# Altium project FlyconforDSP.PrjPcb
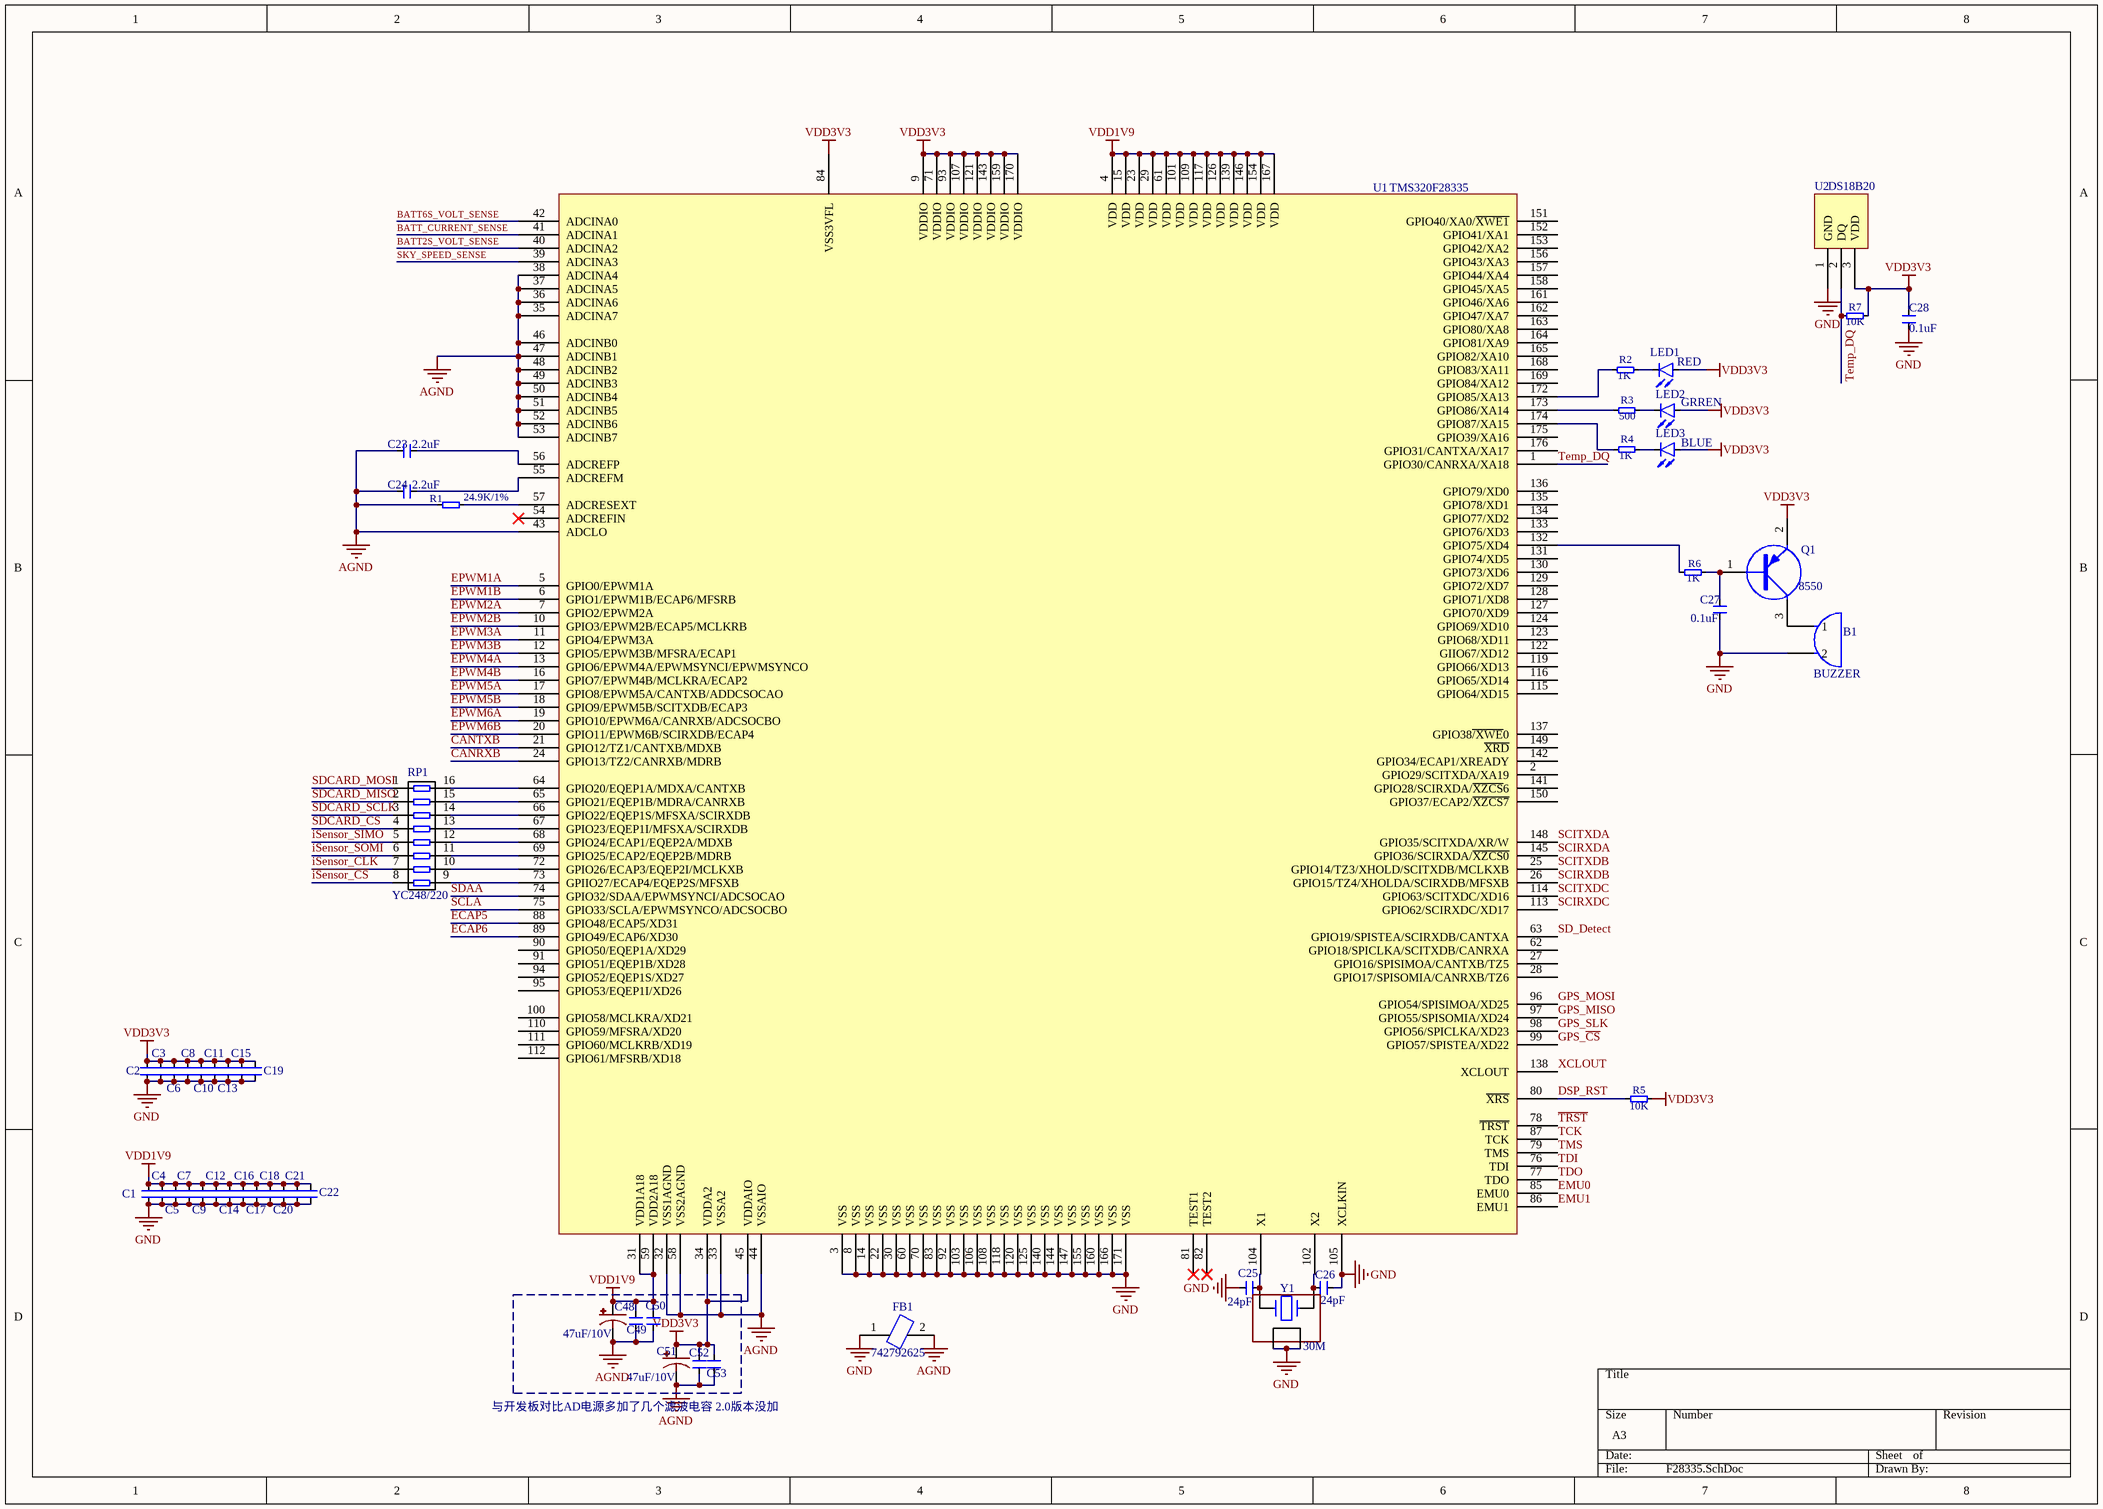
[diagram p0: F28335.SchDoc]
7 sheets, 122 parts. Net scope: global (net labels, ports and power ports of the same name join across sheets).
Board files: PCB.PcbDoc, PCB2.0.PcbDoc
Sheets:
  F28335.SchDoc
  POWER.SchDoc
  IO.SchDoc
  PWM&CAN&SD.SchDoc
  AD.SchDoc
  SBUS.SchDoc
  GPS.SchDoc

## Sheet F28335.SchDoc
size A3

### Parts
B1  BUZZER  [SMD-Beep(9.6*9.6)]
C1  0.1uF  [0603C]  (value not drawn)
C2  0.1uF  [0603C]  (value not drawn)
C3  0.1uF  [0603C]  (value not drawn)
C4  0.1uF  [0603C]  (value not drawn)
C5  0.1uF  [0603C]  (value not drawn)
C6  0.1uF  [0603C]  (value not drawn)
C7  0.1uF  [0603C]  (value not drawn)
C8  0.1uF  [0603C]  (value not drawn)
C9  0.1uF  [0603C]  (value not drawn)
C10  0.1uF  [0603C]  (value not drawn)
C11  0.1uF  [0603C]  (value not drawn)
C12  0.1uF  [0603C]  (value not drawn)
C13  0.1uF  [0603C]  (value not drawn)
C14  0.1uF  [0603C]  (value not drawn)
C15  0.1uF  [0603C]  (value not drawn)
C16  0.1uF  [0603C]  (value not drawn)
C17  0.1uF  [0603C]  (value not drawn)
C18  0.1uF  [0603C]  (value not drawn)
C19  0.1uF  [0603C]  (value not drawn)
C20  0.1uF  [0603C]  (value not drawn)
C21  0.1uF  [0603C]  (value not drawn)
C22  0.1uF  [0603C]  (value not drawn)
C23  2.2uF  [0603C]
C24  2.2uF  [0603C]
C25  24pF  [0603C]
C26  24pF  [0603C]
C27  0.1uF  [0603C]
C28  0.1uF  [0603C]
C48  47uF/10V  [3216/A]
C49  0.1uF  [0603C]  (value not drawn)
C50  0.1uF  [0603C]  (value not drawn)
C51  47uF/10V  [3216/A]
C52  0.1uF  [0603C]  (value not drawn)
C53  0.1uF  [0603C]  (value not drawn)
FB1  742792625  [0603-FB]
LED1  RED  [0603D]
LED2  GRREN  [0603D]
LED3  BLUE  [0603D]
Q1  8550  [SOT23-PNP]
R1  24.9K/1%  [0603R]
R2  1K  [0603R]
R3  500  [0603R]
R4  1K  [0603R]
R5  10K  [0603R]
R6  1K  [0603R]
R7  10K  [0603R]
RP1  YC248/220  [YC248(0603x8)]
U1  TMS320F28335  [LQFP-176]
U2  DS18B20  [TO-92]
Y1  30M  [5032Y]

### Nets
AGND: C23.2 C24.2 C48.2 C49.2 C50.2 C51.2 C52.2 C53.2 FB1.2 R1.1 U1.32(VSS1AGND) U1.33(VSSA2) U1.35(ADCINA7) U1.36(ADCINA6) U1.37(ADCINA5) U1.38(ADCINA4) U1.43(ADCLO) U1.44(VSSAIO) U1.46(ADCINB0) U1.47(ADCINB1) U1.48(ADCINB2) U1.49(ADCINB3) U1.50(ADCINB4) U1.51(ADCINB5) U1.52(ADCINB6) U1.53(ADCINB7) U1.58(VSS2AGND)
GND: B1.2 C1.2 C2.2 C3.2 C4.2 C5.2 C6.2 C7.2 C8.2 C9.2 C10.2 C11.2 C12.2 C13.2 C14.2 C15.2 C16.2 C17.2 C18.2 C19.2 C20.2 C21.2 C22.2 C25.2 C26.1 C27.1 C28.1 FB1.1 U1.3(VSS) U1.8(VSS) U1.14(VSS) U1.22(VSS) U1.30(VSS) U1.60(VSS) U1.70(VSS) U1.83(VSS) U1.92(VSS) U1.103(VSS) U1.105(XCLKIN) U1.106(VSS) U1.108(VSS) U1.118(VSS) U1.120(VSS) U1.125(VSS) U1.140(VSS) U1.144(VSS) U1.147(VSS) U1.155(VSS) U1.160(VSS) U1.166(VSS) U1.171(VSS) U2.1(GND) Y1.2 Y1.4
VDD1V9: C1.1 C4.1 C5.1 C7.1 C9.1 C12.1 C14.1 C16.1 C17.1 C18.1 C20.1 C21.1 C22.1 C48.1 C49.1 C50.1 U1.4(VDD) U1.15(VDD) U1.23(VDD) U1.29(VDD) U1.31(VDD1A18) U1.59(VDD2A18) U1.61(VDD) U1.101(VDD) U1.109(VDD) U1.117(VDD) U1.126(VDD) U1.139(VDD) U1.146(VDD) U1.154(VDD) U1.167(VDD)
VDD3V3: C2.1 C3.1 C6.1 C8.1 C10.1 C11.1 C13.1 C15.1 C19.1 C28.2 C51.1 C52.1 C53.1 LED1.1 LED2.1 LED3.1 Q1.2(E) R5.2 R7.1 U1.9(VDDIO) U1.34(VDDA2) U1.45(VDDAIO) U1.71(VDDIO) U1.84(VSS3VFL) U1.93(VDDIO) U1.107(VDDIO) U1.121(VDDIO) U1.143(VDDIO) U1.159(VDDIO) U1.170(VDDIO) U2.3(VDD)
BATT2S_VOLT_SENSE: U1.40(ADCINA2)
BATT6S_VOLT_SENSE: U1.42(ADCINA0)
BATT_CURRENT_SENSE: U1.41(ADCINA1)
CANRXB: U1.24(GPIO13/TZ2/CANRXB/MDRB)
CANTXB: U1.21(GPIO12/TZ1/CANTXB/MDXB)
DSP_RST: R5.1 U1.80(~{XRS})
ECAP5: U1.88(GPIO48/ECAP5/XD31)
ECAP6: U1.89(GPIO49/ECAP6/XD30)
EMU0: U1.85(EMU0)
EMU1: U1.86(EMU1)
EPWM1A: U1.5(GPIO0/EPWM1A)
EPWM1B: U1.6(GPIO1/EPWM1B/ECAP6/MFSRB)
EPWM2A: U1.7(GPIO2/EPWM2A)
EPWM2B: U1.10(GPIO3/EPWM2B/ECAP5/MCLKRB)
EPWM3A: U1.11(GPIO4/EPWM3A)
EPWM3B: U1.12(GPIO5/EPWM3B/MFSRA/ECAP1)
EPWM4A: U1.13(GPIO6/EPWM4A/EPWMSYNCI/EPWMSYNCO)
EPWM4B: U1.16(GPIO7/EPWM4B/MCLKRA/ECAP2)
EPWM5A: U1.17(GPIO8/EPWM5A/CANTXB/ADDCSOCAO)
EPWM5B: U1.18(GPIO9/EPWM5B/SCITXDB/ECAP3)
EPWM6A: U1.19(GPIO10/EPWM6A/CANRXB/ADCSOCBO)
EPWM6B: U1.20(GPIO11/EPWM6B/SCIRXDB/ECAP4)
GPS_~{CS}: U1.99(GPIO57/SPISTEA/XD22)
GPS_MISO: U1.97(GPIO55/SPISOMIA/XD24)
GPS_MOSI: U1.96(GPIO54/SPISIMOA/XD25)
GPS_SLK: U1.98(GPIO56/SPICLKA/XD23)
~{iSensor_CS}: RP1.8
iSensor_CLK: RP1.7
iSensor_SIMO: RP1.5
iSensor_SOMI: RP1.6
SCIRXDA: U1.145(GPIO36/SCIRXDA/~{XZCS0})
SCIRXDB: U1.26(GPIO15/TZ4/XHOLDA/SCIRXDB/MFSXB)
SCIRXDC: U1.113(GPIO62/SCIRXDC/XD17)
SCITXDA: U1.148(GPIO35/SCITXDA/XR/W)
SCITXDB: U1.25(GPIO14/TZ3/XHOLD/SCITXDB/MCLKXB)
SCITXDC: U1.114(GPIO63/SCITXDC/XD16)
SCLA: U1.75(GPIO33/SCLA/EPWMSYNCO/ADCSOCBO)
SD_Detect: U1.63(GPIO19/SPISTEA/SCIRXDB/CANTXA)
SDAA: U1.74(GPIO32/SDAA/EPWMSYNCI/ADCSOCAO)
SDCARD_CS: RP1.4
SDCARD_MISO: RP1.2
SDCARD_MOSI: RP1.1
SDCARD_SCLK: RP1.3
SKY_SPEED_SENSE: U1.39(ADCINA3)
~{TRST}: U1.78(~{TRST})
TCK: U1.87(TCK)
TDI: U1.76(TDI)
TDO: U1.77(TDO)
Temp_DQ: R7.2 U1.1(GPIO30/CANRXA/XA18) U2.2(DQ)
TMS: U1.79(TMS)
XCLOUT: U1.138(XCLOUT)
NetB1_1: B1.1 Q1.3(C)
NetC23_1: C23.1 U1.56(ADCREFP)
NetC24_1: C24.1 U1.55(ADCREFM)
NetC25_1: C25.1 U1.104(X1) Y1.1
NetC26_2: C26.2 U1.102(X2) Y1.3
NetC27_2: C27.2 Q1.1(B) R6.2
NetLED1_2: LED1.2 R2.2
NetLED2_2: LED2.2 R3.2
NetLED3_2: LED3.2 R4.2
NetR1_2: R1.2 U1.57(ADCRESEXT)
NetR2_1: R2.1 U1.172(GPIO85/XA13)
NetR3_1: R3.1 U1.173(GPIO86/XA14)
NetR4_1: R4.1 U1.174(GPIO87/XA15)
NetR6_1: R6.1 U1.132(GPIO75/XD4)
NetRP1_9: RP1.9 U1.73(GPIIO27/ECAP4/EQEP2S/MFSXB)
NetRP1_10: RP1.10 U1.72(GPIO26/ECAP3/EQEP2I/MCLKXB)
NetRP1_11: RP1.11 U1.69(GPIO25/ECAP2/EQEP2B/MDRB)
NetRP1_12: RP1.12 U1.68(GPIO24/ECAP1/EQEP2A/MDXB)
NetRP1_13: RP1.13 U1.67(GPIO23/EQEP1I/MFSXA/SCIRXDB)
NetRP1_14: RP1.14 U1.66(GPIO22/EQEP1S/MFSXA/SCIRXDB)
NetRP1_15: RP1.15 U1.65(GPIO21/EQEP1B/MDRA/CANRXB)
NetRP1_16: RP1.16 U1.64(GPIO20/EQEP1A/MDXA/CANTXB)

Not connected (* = marked no-connect by the designer): U1 2(GPIO29/SCITXDA/XA19) 27(GPIO16/SPISIMOA/CANTXB/TZ5) 28(GPIO17/SPISOMIA/CANRXB/TZ6) 54(ADCREFIN)* 62(GPIO18/SPICLKA/SCITXDB/CANRXA) 81(TEST1)* 82(TEST2)* 90(GPIO50/EQEP1A/XD29) 91(GPIO51/EQEP1B/XD28) 94(GPIO52/EQEP1S/XD27) 95(GPIO53/EQEP1I/XD26) 100(GPIO58/MCLKRA/XD21) 110(GPIO59/MFSRA/XD20) 111(GPIO60/MCLKRB/XD19) 112(GPIO61/MFSRB/XD18) 115(GPIO64/XD15) 116(GPIO65/XD14) 119(GPIO66/XD13) 122(GIIO67/XD12) 123(GPIO68/XD11) 124(GPIO69/XD10) 127(GPIO70/XD9) 128(GPIO71/XD8) 129(GPIO72/XD7) 130(GPIO73/XD6) 131(GPIO74/XD5) 133(GPIO76/XD3) 134(GPIO77/XD2) 135(GPIO78/XD1) 136(GPIO79/XD0) 137(GPIO38~{/XWE}0) 141(GPIO28/SCIRXDA/~{XZCS}6) 142(GPIO34/ECAP1/XREADY) 149(~{XRD}) 150(GPIO37/ECAP2/~{XZCS7}) 151(GPIO40/XA0/~{XWE1}) 152(GPIO41/XA1) 153(GPIO42/XA2) 156(GPIO43/XA3) 157(GPIO44/XA4) 158(GPIO45/XA5) 161(GPIO46/XA6) 162(GPIO47/XA7) 163(GPIO80/XA8) 164(GPIO81/XA9) 165(GPIO82/XA10) 168(GPIO83/XA11) 169(GPIO84/XA12) 175(GPIO39/XA16) 176(GPIO31/CANTXA/XA17)

### Notes on the sheet
- 与开发板对比AD电源多加了几个滤波电容 2.0版本没加

### Library data of the parts
C1-C28 C49 C50 C52 C53 = C
C48 C51 = C-POLAR
FB1 = FB
LED1-LED3 = LED
Q1 = PNP: PNP Transistor
R1-R7 = R
RP1 = RP
Y1 = Crystal-4

## Sheet POWER.SchDoc
size A3
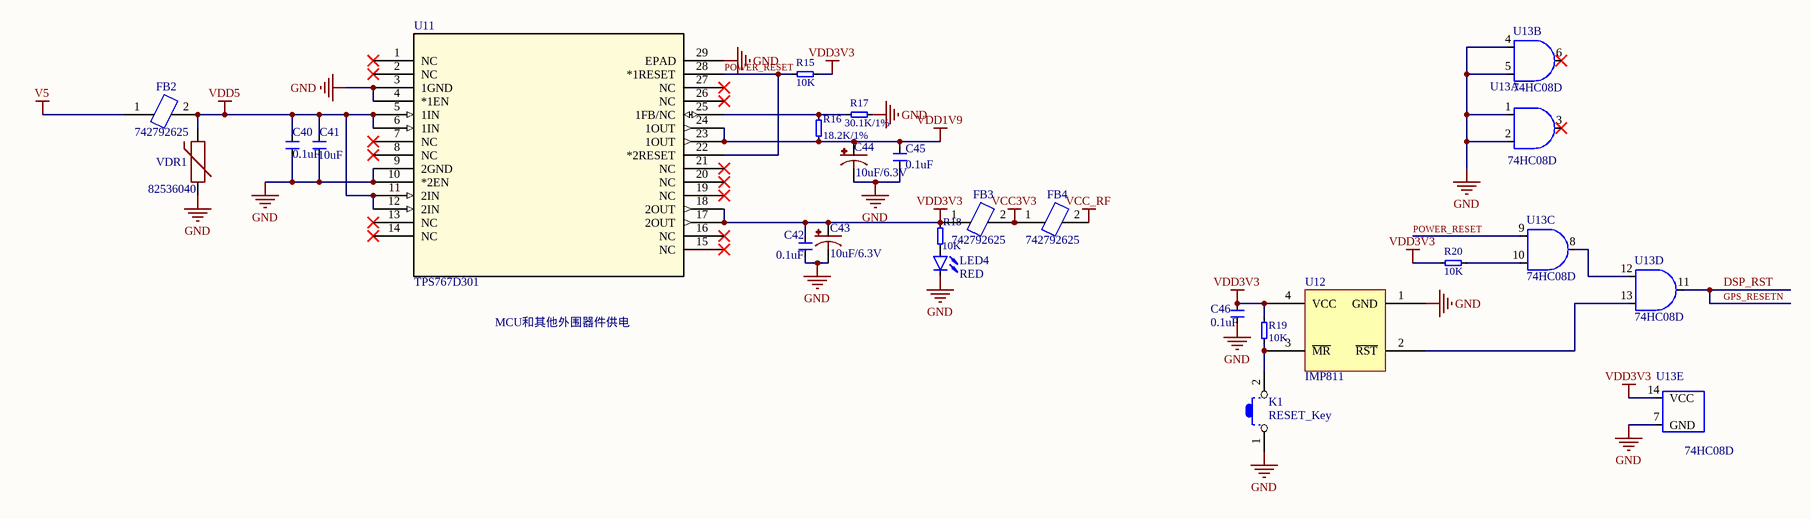
[diagram p1: POWER.SchDoc]

### Parts
C40  0.1uF  [0603C]
C41  10uF  [0603C]
C42  0.1uF  [0603C]
C43  10uF/6.3V  [3216/A]
C44  10uF/6.3V  [3216/A]
C45  0.1uF  [0603C]
C46  0.1uF  [0603C]
FB2  742792625  [0603-FB]
FB3  742792625  [0603-FB]
FB4  742792625  [0603-FB]
K1  RESET_Key  [KEY(2*4*3.5)]
LED4  RED  [0603D]
R15  10K  [0603R]
R16  18.2K/1%  [0603R]
R17  30.1K/1%  [0603R]
R18  10K  [0603R]
R19  10K  [0603R]
R20  10K  [0603R]
U11  TPS767D301  [TPS767D301]
U12  IMP811  [IMP811]
U13  74HC08D  [TSSOP14]  (parts A,B,C,D,E of 5)
VDR1  82536040  [0603R]

### Nets
GND: C40.1 C41.1 C42.1 C43.2 C44.2 C45.1 C46.1 K1.1 LED4.2 R17.1 U11.3(1GND) U11.4(*1EN) U11.9(2GND) U11.10(*2EN) U11.29(EPAD) U12.1(GND) U13.1 U13.2 U13.4 U13.5 U13.7(GND) VDR1.1
V5: FB2.1
VCC3V3: FB3.2 FB4.1
VCC_RF: FB4.2
VDD1V9: C44.1 C45.2 R16.1 U11.23(1OUT) U11.24(1OUT)
VDD3V3: C42.2 C43.1 C46.2 FB3.1 R15.2 R18.2 R19.2 R20.2 U11.17(2OUT) U11.18(2OUT) U12.4(VCC) U13.14(VCC)
VDD5: C40.2 C41.2 FB2.2 U11.5(1IN) U11.6(1IN) U11.11(2IN) U11.12(2IN) VDR1.2
DSP_RST: U13.11  [also labelled GPS_RESETN]
POWER_RESET: R15.1 U11.22(*2RESET) U11.28(*1RESET) U13.9
NetK1_2: K1.2 R19.1 U12.3(~{MR})
NetLED4_1: LED4.1 R18.1
NetR16_2: R16.2 R17.2 U11.25(1FB/NC)
NetR20_1: R20.1 U13.10
NetU12_2: U12.2(~{RST}) U13.13
NetU13_8: U13.8 U13.12

Not connected (* = marked no-connect by the designer): U11 1(NC)* 2(NC)* 7(NC)* 8(NC)* 13(NC)* 14(NC)* 15(NC)* 16(NC)* 19(NC)* 20(NC)* 21(NC)* 26(NC)* 27(NC)*; U13 3* 6*

### Notes on the sheet
- MCU和其他外围器件供电

### Library data of the parts
C40-C42 C45 C46 = C
C43 C44 = C-POLAR
FB2-FB4 = FB
LED4 = LED
R15-R20 = R
U13 = 74HC08D: 2-INPUT AND GATE
VDR1 = Varistor

## Sheet IO.SchDoc
size A4
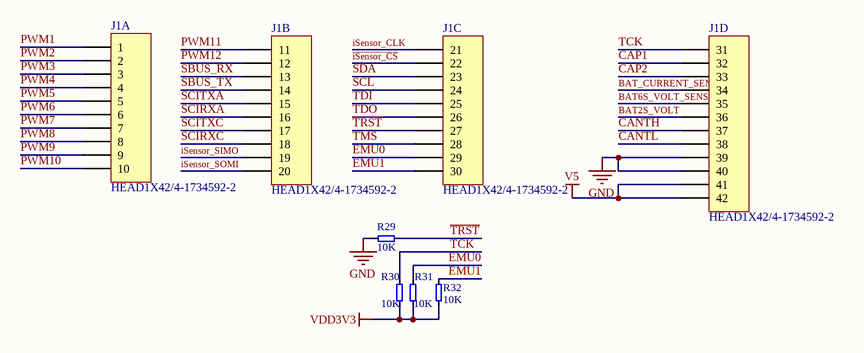
[diagram p2: IO.SchDoc]

### Parts
J1  HEAD1X42/4-1734592-2  [FPC0.5-42]  (parts A,B,C,D of 4)
R29  10K  [0603R]
R30  10K  [0603R]
R31  10K  [0603R]
R32  10K  [0603R]

### Nets
GND: J1.39 J1.40 R29.1
V5: J1.40(41)
VDD3V3: R30.1 R31.1 R32.1
BAT2S_VOLT: J1.36
BAT6S_VOLT_SENSE: J1.35
BAT_CURRENT_SENSE: J1.34
CANTH: J1.37
CANTL: J1.38
CAP1: J1.32
CAP2: J1.33
EMU0: J1.29 R31.2
EMU1: J1.30 R32.2
~{iSensor_CS}: J1.22
iSensor_CLK: J1.21
iSensor_SIMO: J1.19
iSensor_SOMI: J1.20
PWM1: J1.1
PWM2: J1.2
PWM3: J1.3
PWM4: J1.4
PWM5: J1.5
PWM6: J1.6
PWM7: J1.7
PWM8: J1.8
PWM9: J1.9
PWM10: J1.10
PWM11: J1.11
PWM12: J1.12
SBUS_RX: J1.13
SBUS_TX: J1.14
SCIRXA: J1.16
SCIRXC: J1.18
SCITXA: J1.15
SCITXC: J1.17
SCL: J1.24
SDA: J1.23
~{TRST}: J1.27 R29.2
TCK: J1.31 R30.2
TDI: J1.25
TDO: J1.26
TMS: J1.28

### Library data of the parts
J1 = HEAD1X42
R29-R32 = R

## Sheet PWM&CAN&SD.SchDoc
size A4
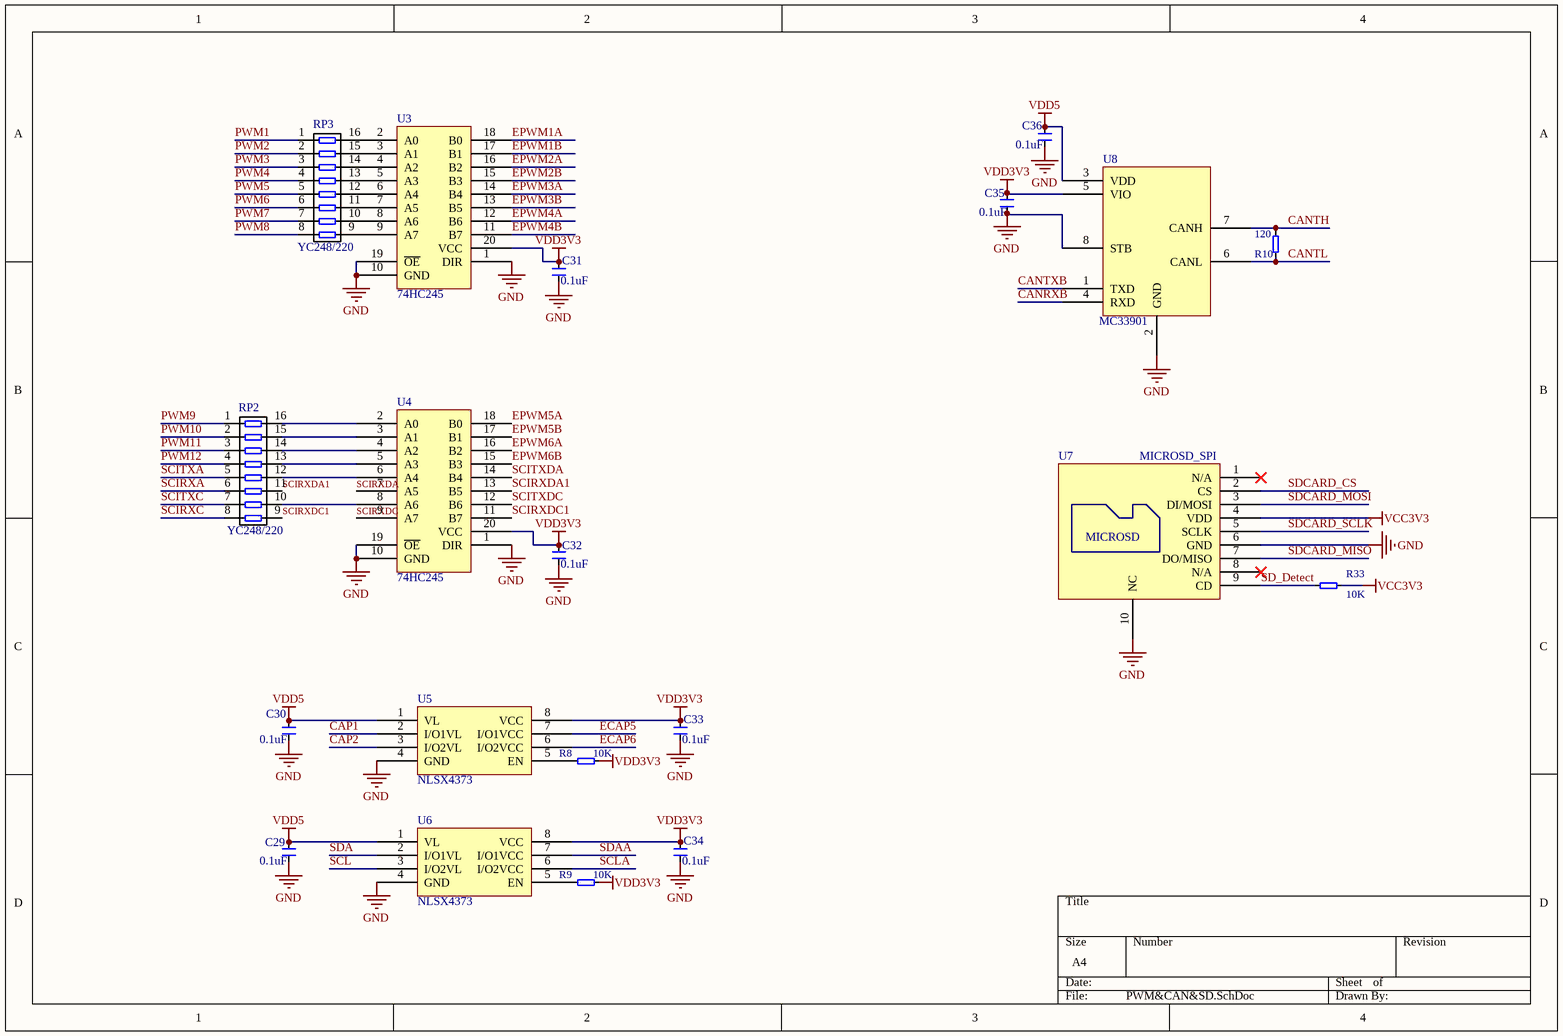
[diagram p3: PWM&CAN&SD.SchDoc]

### Parts
C29  0.1uF  [0603C]
C30  0.1uF  [0603C]
C31  0.1uF  [0603C]
C32  0.1uF  [0603C]
C33  0.1uF  [0603C]
C34  0.1uF  [0603C]
C35  0.1uF  [0603C]
C36  0.1uF  [0603C]
R8  10K  [0603R]
R9  10K  [0603R]
R10  120  [0603R]
R33  10K  [0603R]
RP2  YC248/220  [YC248(0603x8)]
RP3  YC248/220  [YC248(0603x8)]
U3  74HC245  [TSSOP20]
U4  74HC245  [TSSOP20]
U5  NLSX4373  [UDFN8]
U6  NLSX4373  [UDFN8]
U7  MICROSD_SPI  [microsd]
U8  MC33901  [SOIC-8]

### Nets
GND: C29.1 C30.1 C31.1 C32.1 C33.1 C34.1 C35.1 C36.1 U3.1(DIR) U3.10(GND) U3.19(~{OE}) U4.1(DIR) U4.10(GND) U4.19(~{OE}) U5.4(GND) U6.4(GND) U7.6(GND) U7.10(NC) U8.2(GND) U8.8(STB)
VCC3V3: R33.1 U7.4(VDD)
VDD3V3: C31.2 C32.2 C33.2 C34.2 C35.2 R8.2 R9.2 U3.20(VCC) U4.20(VCC) U5.8(VCC) U6.8(VCC) U8.5(VIO)
VDD5: C29.2 C30.2 C36.2 U5.1(VL) U6.1(VL) U8.3(VDD)
CANRXB: U8.4(RXD)
CANTH: R10.1 U8.7(CANH)
CANTL: R10.2 U8.6(CANL)
CANTXB: U8.1(TXD)
CAP1: U5.2(I/O1VL)
CAP2: U5.3(I/O2VL)
ECAP5: U5.7(I/O1VCC)
ECAP6: U5.6(I/O2VCC)
EPWM1A: U3.18(B0)
EPWM1B: U3.17(B1)
EPWM2A: U3.16(B2)
EPWM2B: U3.15(B3)
EPWM3A: U3.14(B4)
EPWM3B: U3.13(B5)
EPWM4A: U3.12(B6)
EPWM4B: U3.11(B7)
EPWM5A: U4.18(B0)
EPWM5B: U4.17(B1)
EPWM6A: U4.16(B2)
EPWM6B: U4.15(B3)
PWM1: RP3.1
PWM2: RP3.2
PWM3: RP3.3
PWM4: RP3.4
PWM5: RP3.5
PWM6: RP3.6
PWM7: RP3.7
PWM8: RP3.8
PWM9: RP2.1
PWM10: RP2.2
PWM11: RP2.3
PWM12: RP2.4
SCIRXA: RP2.6
SCIRXC: RP2.8
SCIRXDA: U4.7(A5)
SCIRXDA1: RP2.11 U4.13(B5)
SCIRXDC: U4.9(A7)
SCIRXDC1: RP2.9 U4.11(B7)
SCITXA: RP2.5
SCITXC: RP2.7
SCITXDA: U4.14(B4)
SCITXDC: U4.12(B6)
SCL: U6.3(I/O2VL)
SCLA: U6.6(I/O2VCC)
SD_Detect: R33.2 U7.9(CD)
SDA: U6.2(I/O1VL)
SDAA: U6.7(I/O1VCC)
SDCARD_CS: U7.2(CS)
SDCARD_MISO: U7.7(DO/MISO)
SDCARD_MOSI: U7.3(DI/MOSI)
SDCARD_SCLK: U7.5(SCLK)
NetR8_1: R8.1 U5.5(EN)
NetR9_1: R9.1 U6.5(EN)
NetRP2_10: RP2.10 U4.8(A6)
NetRP2_12: RP2.12 U4.6(A4)
NetRP2_13: RP2.13 U4.5(A3)
NetRP2_14: RP2.14 U4.4(A2)
NetRP2_15: RP2.15 U4.3(A1)
NetRP2_16: RP2.16 U4.2(A0)
NetRP3_9: RP3.9 U3.9(A7)
NetRP3_10: RP3.10 U3.8(A6)
NetRP3_11: RP3.11 U3.7(A5)
NetRP3_12: RP3.12 U3.6(A4)
NetRP3_13: RP3.13 U3.5(A3)
NetRP3_14: RP3.14 U3.4(A2)
NetRP3_15: RP3.15 U3.3(A1)
NetRP3_16: RP3.16 U3.2(A0)

Not connected (* = marked no-connect by the designer): U7 1(N/A)* 8(N/A)*

### Notes on the sheet
- (in symbol MICROSD_SPI) MICROSD

### Library data of the parts
C29-C36 = C
R8-R10 R33 = R
RP2 RP3 = RP

## Sheet AD.SchDoc
size A4
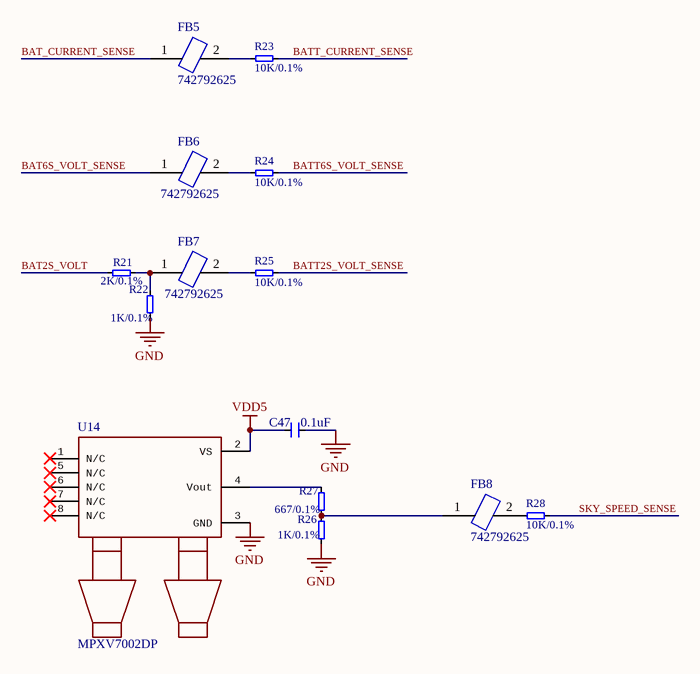
[diagram p4: AD.SchDoc]

### Parts
C47  0.1uF  [0603C]
FB5  742792625  [0603-FB]
FB6  742792625  [0603-FB]
FB7  742792625  [0603-FB]
FB8  742792625  [0603-FB]
R21  2K/0.1%  [0603R]
R22  1K/0.1%  [0603R]
R23  10K/0.1%  [0603R]
R24  10K/0.1%  [0603R]
R25  10K/0.1%  [0603R]
R26  1K/0.1%  [0603R]
R27  667/0.1%  [0603R]
R28  10K/0.1%  [0603R]
U14  MPXV7002DP  [MPXV7002DP]

### Nets
GND: C47.1 R22.2 R26.1 U14.3(GND)
VDD5: C47.2 U14.2(VS)
BAT2S_VOLT: R21.1
BAT6S_VOLT_SENSE: FB6.1
BAT_CURRENT_SENSE: FB5.1
BATT2S_VOLT_SENSE: R25.1
BATT6S_VOLT_SENSE: R24.1
BATT_CURRENT_SENSE: R23.1
SKY_SPEED_SENSE: R28.1
NetFB5_2: FB5.2 R23.2
NetFB6_2: FB6.2 R24.2
NetFB7_1: FB7.1 R21.2 R22.1
NetFB7_2: FB7.2 R25.2
NetFB8_1: FB8.1 R26.2 R27.1
NetFB8_2: FB8.2 R28.2
NetR27_2: R27.2 U14.4(Vout)

Not connected (* = marked no-connect by the designer): U14 1(N/C)* 5(N/C)* 6(N/C)* 7(N/C)* 8(N/C)*

### Library data of the parts
C47 = C
FB5-FB8 = FB
R21-R28 = R

## Sheet SBUS.SchDoc
size A4
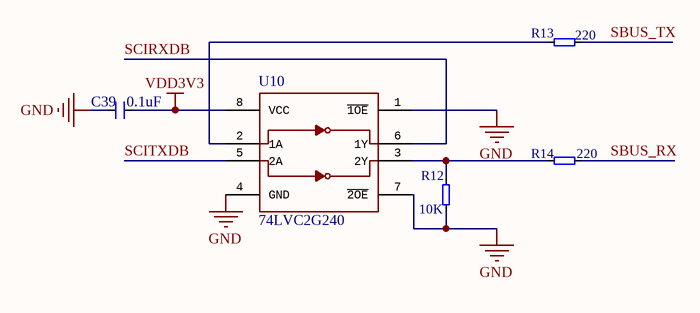
[diagram p5: SBUS.SchDoc]

### Parts
C39  0.1uF  [0603C]
R12  10K  [0603R]
R13  220  [0603R]
R14  220  [0603R]
U10  74LVC2G240  [VSSOP8-0.5]

### Nets
GND: C39.2 R12.2 U10.1(~{1OE}) U10.4(GND) U10.7(~{2OE})
VDD3V3: C39.1 U10.8(VCC)
SBUS_RX: R14.1
SBUS_TX: R13.1
SCIRXDB: U10.6(1Y)
SCITXDB: U10.5(2A)
NetR12_1: R12.1 R14.2 U10.3(2Y)
NetR13_2: R13.2 U10.2(1A)

### Library data of the parts
C39 = C
R12-R14 = R

## Sheet GPS.SchDoc
size A4
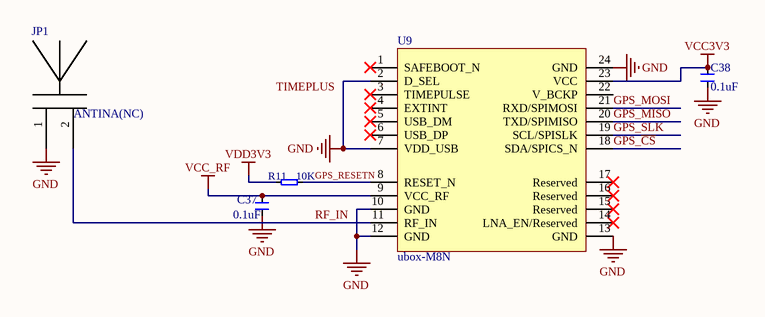
[diagram p6: GPS.SchDoc]

### Parts
C37  0.1uF  [0603C]
C38  0.1uF  [0603C]
JP1  ANTINA(NC)  [IPEX-20279-00E-03]
R11  10K  [0603R]
U9  ubox-M8N  [ublox-M8]

### Nets
GND: C37.2 C38.1 JP1.1 U9.2(D_SEL) U9.7(VDD_USB) U9.10(GND) U9.12(GND) U9.13(GND) U9.24(GND)
VCC3V3: C38.2 U9.23(VCC)
VCC_RF: C37.1 U9.9(VCC_RF)
VDD3V3: R11.1
GPS_~{CS}: U9.18(SDA/SPICS_N)
GPS_MISO: U9.20(TXD/SPIMISO)
GPS_MOSI: U9.21(RXD/SPIMOSI)
GPS_RESETN: R11.2 U9.8(RESET_N)  [project net DSP_RST]
GPS_SLK: U9.19(SCL/SPISLK)
RF_IN: JP1.2 U9.11(RF_IN)

Not connected (* = marked no-connect by the designer): U9 1(SAFEBOOT_N)* 3(TIMEPULSE)* 4(EXTINT)* 5(USB_DM)* 6(USB_DP)* 14(LNA_EN/Reserved)* 15(Reserved)* 16(Reserved)* 17(Reserved)* 22(V_BCKP)

### Notes on the sheet
- Labels drawn without touching a wire or pin: TIMEPLUS

### Library data of the parts
C37 C38 = C
JP1 = ANTINA
R11 = R

## Nets that join several sheets
GND: F28335 (54 pins), POWER (22 pins), IO (J1.39 J1.40 R29.1), PWM&CAN&SD (20 pins), AD (C47.1 R22.2 R26.1 U14.3), SBUS (5 pins), GPS (9 pins)
V5: POWER (FB2.1), IO (J1.40)
VCC3V3: POWER (FB3.2 FB4.1), PWM&CAN&SD (R33.1 U7.4), GPS (C38.2 U9.23)
VCC_RF: POWER (FB4.2), GPS (C37.1 U9.9)
VDD1V9: F28335 (31 pins), POWER (5 pins)
VDD3V3: F28335 (31 pins), POWER (12 pins), IO (R30.1 R31.1 R32.1), PWM&CAN&SD (12 pins), SBUS (C39.1 U10.8), GPS (R11.1)
VDD5: POWER (8 pins), PWM&CAN&SD (6 pins), AD (C47.2 U14.2)
BAT2S_VOLT: IO (J1.36), AD (R21.1)
BAT6S_VOLT_SENSE: IO (J1.35), AD (FB6.1)
BAT_CURRENT_SENSE: IO (J1.34), AD (FB5.1)
BATT2S_VOLT_SENSE: F28335 (U1.40), AD (R25.1)
BATT6S_VOLT_SENSE: F28335 (U1.42), AD (R24.1)
BATT_CURRENT_SENSE: F28335 (U1.41), AD (R23.1)
CANRXB: F28335 (U1.24), PWM&CAN&SD (U8.4)
CANTH: IO (J1.37), PWM&CAN&SD (R10.1 U8.7)
CANTL: IO (J1.38), PWM&CAN&SD (R10.2 U8.6)
CANTXB: F28335 (U1.21), PWM&CAN&SD (U8.1)
CAP1: IO (J1.32), PWM&CAN&SD (U5.2)
CAP2: IO (J1.33), PWM&CAN&SD (U5.3)
DSP_RST: F28335 (R5.1 U1.80), POWER (U13.11), GPS (R11.2 U9.8)
ECAP5: F28335 (U1.88), PWM&CAN&SD (U5.7)
ECAP6: F28335 (U1.89), PWM&CAN&SD (U5.6)
EMU0: F28335 (U1.85), IO (J1.29 R31.2)
EMU1: F28335 (U1.86), IO (J1.30 R32.2)
EPWM1A: F28335 (U1.5), PWM&CAN&SD (U3.18)
EPWM1B: F28335 (U1.6), PWM&CAN&SD (U3.17)
EPWM2A: F28335 (U1.7), PWM&CAN&SD (U3.16)
EPWM2B: F28335 (U1.10), PWM&CAN&SD (U3.15)
EPWM3A: F28335 (U1.11), PWM&CAN&SD (U3.14)
EPWM3B: F28335 (U1.12), PWM&CAN&SD (U3.13)
EPWM4A: F28335 (U1.13), PWM&CAN&SD (U3.12)
EPWM4B: F28335 (U1.16), PWM&CAN&SD (U3.11)
EPWM5A: F28335 (U1.17), PWM&CAN&SD (U4.18)
EPWM5B: F28335 (U1.18), PWM&CAN&SD (U4.17)
EPWM6A: F28335 (U1.19), PWM&CAN&SD (U4.16)
EPWM6B: F28335 (U1.20), PWM&CAN&SD (U4.15)
GPS_~{CS}: F28335 (U1.99), GPS (U9.18)
GPS_MISO: F28335 (U1.97), GPS (U9.20)
GPS_MOSI: F28335 (U1.96), GPS (U9.21)
GPS_SLK: F28335 (U1.98), GPS (U9.19)
~{iSensor_CS}: F28335 (RP1.8), IO (J1.22)
iSensor_CLK: F28335 (RP1.7), IO (J1.21)
iSensor_SIMO: F28335 (RP1.5), IO (J1.19)
iSensor_SOMI: F28335 (RP1.6), IO (J1.20)
PWM1: IO (J1.1), PWM&CAN&SD (RP3.1)
PWM2: IO (J1.2), PWM&CAN&SD (RP3.2)
PWM3: IO (J1.3), PWM&CAN&SD (RP3.3)
PWM4: IO (J1.4), PWM&CAN&SD (RP3.4)
PWM5: IO (J1.5), PWM&CAN&SD (RP3.5)
PWM6: IO (J1.6), PWM&CAN&SD (RP3.6)
PWM7: IO (J1.7), PWM&CAN&SD (RP3.7)
PWM8: IO (J1.8), PWM&CAN&SD (RP3.8)
PWM9: IO (J1.9), PWM&CAN&SD (RP2.1)
PWM10: IO (J1.10), PWM&CAN&SD (RP2.2)
PWM11: IO (J1.11), PWM&CAN&SD (RP2.3)
PWM12: IO (J1.12), PWM&CAN&SD (RP2.4)
SBUS_RX: IO (J1.13), SBUS (R14.1)
SBUS_TX: IO (J1.14), SBUS (R13.1)
SCIRXA: IO (J1.16), PWM&CAN&SD (RP2.6)
SCIRXC: IO (J1.18), PWM&CAN&SD (RP2.8)
SCIRXDA: F28335 (U1.145), PWM&CAN&SD (U4.7)
SCIRXDB: F28335 (U1.26), SBUS (U10.6)
SCIRXDC: F28335 (U1.113), PWM&CAN&SD (U4.9)
SCITXA: IO (J1.15), PWM&CAN&SD (RP2.5)
SCITXC: IO (J1.17), PWM&CAN&SD (RP2.7)
SCITXDA: F28335 (U1.148), PWM&CAN&SD (U4.14)
SCITXDB: F28335 (U1.25), SBUS (U10.5)
SCITXDC: F28335 (U1.114), PWM&CAN&SD (U4.12)
SCL: IO (J1.24), PWM&CAN&SD (U6.3)
SCLA: F28335 (U1.75), PWM&CAN&SD (U6.6)
SD_Detect: F28335 (U1.63), PWM&CAN&SD (R33.2 U7.9)
SDA: IO (J1.23), PWM&CAN&SD (U6.2)
SDAA: F28335 (U1.74), PWM&CAN&SD (U6.7)
SDCARD_CS: F28335 (RP1.4), PWM&CAN&SD (U7.2)
SDCARD_MISO: F28335 (RP1.2), PWM&CAN&SD (U7.7)
SDCARD_MOSI: F28335 (RP1.1), PWM&CAN&SD (U7.3)
SDCARD_SCLK: F28335 (RP1.3), PWM&CAN&SD (U7.5)
SKY_SPEED_SENSE: F28335 (U1.39), AD (R28.1)
~{TRST}: F28335 (U1.78), IO (J1.27 R29.2)
TCK: F28335 (U1.87), IO (J1.31 R30.2)
TDI: F28335 (U1.76), IO (J1.25)
TDO: F28335 (U1.77), IO (J1.26)
TMS: F28335 (U1.79), IO (J1.28)